# EasyEDA schematic schematic_v1.0.4.json
TITLE: Sheet_1; REV: 1.0; Date: 2023-06-23; Sheet: 1/1; Drawn By: Swapnil Jadhav; Company: XSPEEDAI
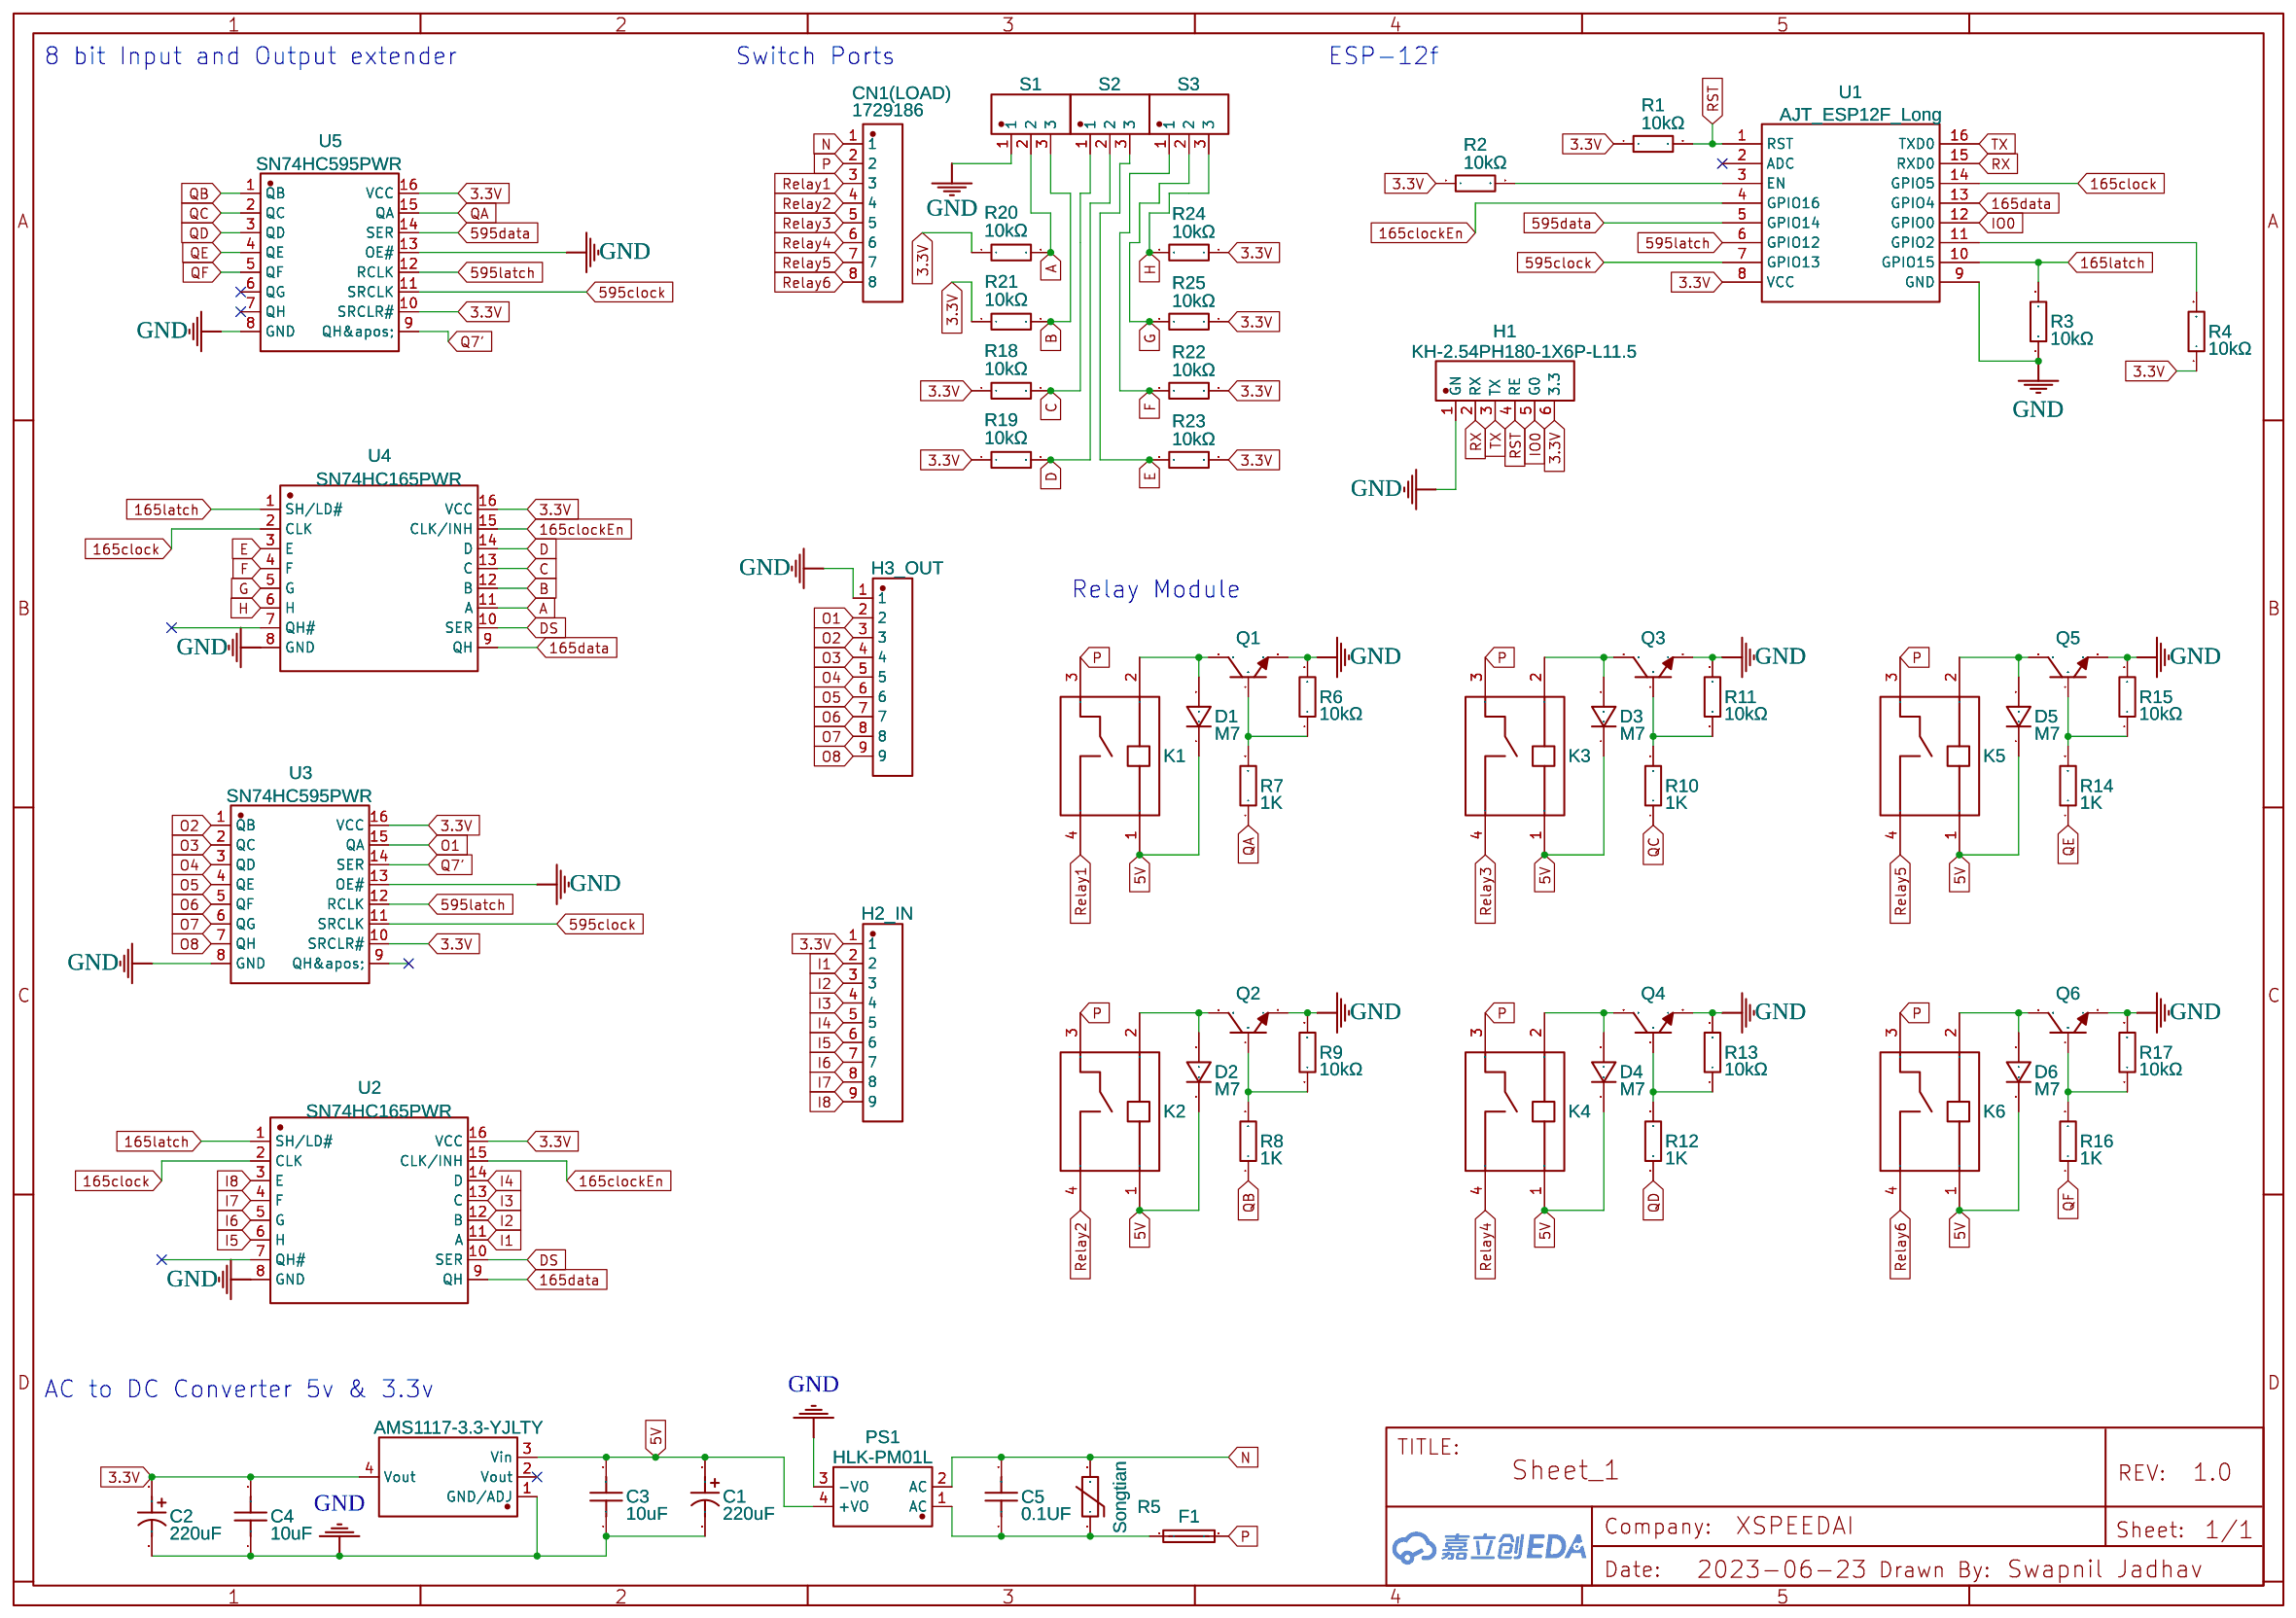
[diagram p0: schematic sheet]

## Parts
C1  220uF  [CAP-SMD_BD6.3-L6.6-W6.6-LS7.2-FD]
C2  220uF  [CAP-SMD_BD6.3-L6.6-W6.6-LS7.2-FD]
C3  10uF  [C0805]
C4  10uF  [C0805]
C5  0.1UF  [CAP-TH_L10.0-W4.5-P7.50-D0.6]
CN1(LOAD)  1729186  [CONN-TH_PHOENIX_1729186]
D1  M7  [SMA_L4.4-W2.8-LS5.4-RD]
D2  M7  [SMA_L4.4-W2.8-LS5.4-RD]
D3  M7  [SMA_L4.4-W2.8-LS5.4-RD]
D4  M7  [SMA_L4.4-W2.8-LS5.4-RD]
D5  M7  [SMA_L4.4-W2.8-LS5.4-RD]
D6  M7  [SMA_L4.4-W2.8-LS5.4-RD]
F1  2009T500MA250V  [FUSE-TH_L8.3-W4.1-P5.08-D0.6]
H1  KH-2.54PH180-1X6P-L11.5  [HDR-TH_6P-P2.54-V-M-1]
H2_IN  KH-2.54PH180-1X9P-L11.5  [HDR-TH_9P-P2.54-V-M]
H3_OUT  KH-2.54PH180-1X9P-L11.5  [HDR-TH_9P-P2.54-V-M]
K1  HF7520-005-HSTP  [RELAY-TH_HF7520-005-HSTP]
K2  HF7520-005-HSTP  [RELAY-TH_HF7520-005-HSTP]
K3  HF7520-005-HSTP  [RELAY-TH_HF7520-005-HSTP]
K4  HF7520-005-HSTP  [RELAY-TH_HF7520-005-HSTP]
K5  HF7520-005-HSTP  [RELAY-TH_HF7520-005-HSTP]
K6  HF7520-005-HSTP  [RELAY-TH_HF7520-005-HSTP]
NO1  AMS1117-3.3-YJLTY  [SOT-223-3_L6.5-W3.4-P2.30-LS7.0-BR]
PS1  HLK-PM01L  [HLK-PM01L]
Q1  SS8050_C181160  [SOT-23-3_L2.9-W1.6-P1.90-LS2.8-BR]
Q2  SS8050_C181160  [SOT-23-3_L2.9-W1.6-P1.90-LS2.8-BR]
Q3  SS8050_C181160  [SOT-23-3_L2.9-W1.6-P1.90-LS2.8-BR]
Q4  SS8050_C181160  [SOT-23-3_L2.9-W1.6-P1.90-LS2.8-BR]
Q5  SS8050_C181160  [SOT-23-3_L2.9-W1.6-P1.90-LS2.8-BR]
Q6  SS8050_C181160  [SOT-23-3_L2.9-W1.6-P1.90-LS2.8-BR]
R1  10kΩ  [R0805]
R2  10kΩ  [R0805]
R3  10kΩ  [R0805]
R4  10kΩ  [R0805]
R5  Songtian  [RES-TH_L14.0-W4.9-P7.50-D0.8-S4.90]
R6  10kΩ  [R0805]
R7  1K  [R0805]
R8  1K  [R0805]
R9  10kΩ  [R0805]
R10  1K  [R0805]
R11  10kΩ  [R0805]
R12  1K  [R0805]
R13  10kΩ  [R0805]
R14  1K  [R0805]
R15  10kΩ  [R0805]
R16  1K  [R0805]
R17  10kΩ  [R0805]
R18  10kΩ  [R0805]
R19  10kΩ  [R0805]
R20  10kΩ  [R0805]
R21  10kΩ  [R0805]
R22  10kΩ  [R0805]
R23  10kΩ  [R0805]
R24  10kΩ  [R0805]
R25  10kΩ  [R0805]
S1  TY381-3.5-03P-14-00AH  [CONN-TH_3P-P3.50_TOPONELEC_TY381-3.5-03P-14-00AH]
S2  TY381-3.5-03P-14-00AH  [CONN-TH_3P-P3.50_TOPONELEC_TY381-3.5-03P-14-00AH]
S3  TY381-3.5-03P-14-00AH  [CONN-TH_3P-P3.50_TOPONELEC_TY381-3.5-03P-14-00AH]
U1  AJT_ESP12F_Long  [AJT_ESP12F_LONG]
U2  SN74HC165PWR  [TSSOP-16_L5.0-W4.4-P0.65-LS6.4-BL]
U3  SN74HC595PWR  [TSSOP-16_L5.0-W4.4-P0.65-LS6.4-BL]
U4  SN74HC165PWR  [TSSOP-16_L5.0-W4.4-P0.65-LS6.4-BL]
U5  SN74HC595PWR  [TSSOP-16_L5.0-W4.4-P0.65-LS6.4-BL]

## Library data of the parts
C1 C2 = MVG 16V 220UF 6.3*7.7: Supplier: LCSC; Supplier Part: C2827940; Manufacturer: SAMYOUNG(韩国三莹); JLCPCB Part Class: Extended Part; Contributor: LCSC
C3 C4 = TCC0805X7R106K100FT: Supplier: LCSC; Supplier Part: C380346; Manufacturer: CCTC(三环); Contributor: LCSC; JLCPCB Part Class: Extended Part
C5 = 250V 0.1UF 5% CBBCapacitor: Supplier: LCSC; Manufacturer: ReliaPro; Supplier Part: C46804
CN1(LOAD) = 1729186: Supplier: LCSC; Supplier Part: C3019615; Manufacturer: Phoenix Contact(菲尼克斯); link: https://atta.szlcsc.com/upload/public/pdf/source/20220519/FDD1F0DA252B24ADE57C07AA9124BB79.pdf; Contributor: lcsc; JLCPCB Part Class: Extended Part
D1-D6 = M7: Supplier: LCSC; Supplier Part: C266550; Manufacturer: BORN(伯恩半导体); Contributor: LCSC; JLCPCB Part Class: Extended Part
F1 = 2009T500MA250V: Supplier: LCSC; Supplier Part: C529783; Manufacturer: Hongda(泓达); Manufacturer Part: 2009T500mA250V; Contributor: LCSC; JLCPCB Part Class: Extended Part
H1 = KH-2.54PH180-1X6P-L11.5: Supplier: LCSC; Supplier Part: C2905486; Manufacturer: kinghelm(金航标); Contributor: LCSC; JLCPCB Part Class: Extended Part
H2_IN H3_OUT = KH-2.54PH180-1X9P-L11.5: Supplier: LCSC; Supplier Part: C2932701; Manufacturer: kinghelm(金航标); Contributor: LCSC; JLCPCB Part Class: Extended Part
K1-K6 = HF7520-005-HSTP: Supplier: LCSC; Manufacturer: HF(宏发); Contributor: LCSC; Supplier Part: C126229; JLCPCB Part Class: Extended Part
NO1 = AMS1117-3.3-YJLTY: Supplier: LCSC; Supplier Part: C9900003397; JLCPCB Part Class: Extended Part; Contributor: LCSC; Manufacturer: null
PS1 = HLK-PM01L: Supplier: HI-LINK; Manufacturer: HI-LINK; Contributor: sbatraAmolvo
Q1-Q6 = SS8050_C181160: Supplier: LCSC; Manufacturer: Hottech(合科泰); Manufacturer Part: SS8050; Contributor: LCSC; Supplier Part: C181160; JLCPCB Part Class: Extended Part
R1-R4 R6 R9 R11 R13 R15 R17-R25 = RMCF0805FT10K0: Supplier: LCSC; Supplier Part: C237755; Manufacturer: SEI(Stackpole Electronics Inc.); Resistance (Ohms): 10K; Contributor: LCSC; JLCPCB Part Class: Extended Part
R5 = STE10D431K1EQ0FST0R0: Supplier: LCSC; Supplier Part: C363065; Manufacturer: STE(松田); Contributor: LCSC; JLCPCB Part Class: Extended Part
R7 R8 R10 R12 R14 R16 = RT0805BRD071KL: Supplier: LCSC; Manufacturer: YAGEO(国巨); Supplier Part: C110774; JLCPCB Part Class: Extended Part; Resistance: 1kΩ
S1-S3 = TY381-3.5-03P-14-00AH: Supplier: LCSC; Supplier Part: C2840326; Manufacturer: Toponelec(拓宜); Contributor: LCSC; JLCPCB Part Class: Extended Part
U1 = AJT_ESP12F_Long: Contributor: AlanTompkins
U2 U4 = SN74HC165PWR: Supplier: LCSC; Manufacturer: TI(德州仪器); Supplier Part: C43420; JLCPCB Part Class: Extended Part
U3 U5 = SN74HC595PWR: Supplier: LCSC; Supplier Part: C273642; Manufacturer: TI(德州仪器); Contributor: LCSC; JLCPCB Part Class: Extended Part

## Nets
3.3V: C2.1 C4.2 H1.6(3.3) H2_IN.1 NO1.4(Vout) R1.1 R2.1 R4.1 R18.1 R19.1 R20.1 R21.1 R22.1 R23.1 R24.1 R25.1 U1.8(VCC) U2.16(VCC) U3.10(SRCLR#) U3.16(VCC) U4.16(VCC) U5.10(SRCLR#) U5.16(VCC)
5V: C1.1 C3.2 D1.1 D2.1 D3.1 D4.1 D5.1 D6.1 K1.1 K2.1 K3.1 K4.1 K5.1 K6.1 NO1.3(Vin) PS1.4(+VO)
GND: C1.2 C2.2 C3.1 C4.1 H1.1(GN) H3_OUT.1 NO1.1(GND/ADJ) PS1.3(-VO) Q1.2(E) Q2.2(E) Q3.2(E) Q4.2(E) Q5.2(E) Q6.2(E) R3.1 R6.2 R9.2 R11.2 R13.2 R15.2 R17.2 S1.1 U1.9(GND) U2.8(GND) U3.8(GND) U3.13(OE#) U4.8(GND) U5.8(GND) U5.13(OE#)
165clock: U1.14(GPIO5) U2.2(CLK) U4.2(CLK)
165clockEn: U1.4(GPIO16) U2.15(CLK/INH) U4.15(CLK/INH)
165data: U1.13(GPIO4) U2.9(QH) U4.9(QH)
165latch: R3.2 U1.10(GPIO15) U2.1(SH/LD#) U4.1(SH/LD#)
595clock: U1.7(GPIO13) U3.11(SRCLK) U5.11(SRCLK)
595data: U1.5(GPIO14) U5.14(SER)
595latch: U1.6(GPIO12) U3.12(RCLK) U5.12(RCLK)
A: R20.2 S1.2 U4.11(A)
B: R21.2 S1.3 U4.12(B)
C: R18.2 S2.1 U4.13(C)
D: R19.2 S2.2 U4.14(D)
DS: U2.10(SER) U4.10(SER)
E: R23.2 S2.3 U4.3(E)
F: R22.2 S3.1 U4.4(F)
G: R25.2 S3.2 U4.5(G)
H: R24.2 S3.3 U4.6(H)
I1: H2_IN.2 U2.11(A)
I2: H2_IN.3 U2.12(B)
I3: H2_IN.4 U2.13(C)
I4: H2_IN.5 U2.14(D)
I5: H2_IN.6 U2.6(H)
I6: H2_IN.7 U2.5(G)
I7: H2_IN.8 U2.4(F)
I8: H2_IN.9 U2.3(E)
IO0: H1.5(G0) U1.12(GPIO0)
N: C5.2 CN1(LOAD).1 PS1.2(AC) R5.2
O1: H3_OUT.2 U3.15(QA)
O2: H3_OUT.3 U3.1(QB)
O3: H3_OUT.4 U3.2(QC)
O4: H3_OUT.5 U3.3(QD)
O5: H3_OUT.6 U3.4(QE)
O6: H3_OUT.7 U3.5(QF)
O7: H3_OUT.8 U3.6(QG)
O8: H3_OUT.9 U3.7(QH)
P: CN1(LOAD).2 F1.2 K1.3 K2.3 K3.3 K4.3 K5.3 K6.3
Q7': U3.14(SER) U5.9(QH')
QA: R7.1 U5.15(QA)
QB: R8.1 U5.1(QB)
QC: R10.1 U5.2(QC)
QD: R12.1 U5.3(QD)
QE: R14.1 U5.4(QE)
QF: R16.1 U5.5(QF)
Relay1: CN1(LOAD).3 K1.4
Relay2: CN1(LOAD).4 K2.4
Relay3: CN1(LOAD).5 K3.4
Relay4: CN1(LOAD).6 K4.4
Relay5: CN1(LOAD).7 K5.4
Relay6: CN1(LOAD).8 K6.4
RST: H1.4(RE) R1.2 U1.1(RST)
RX: H1.2(RX) U1.15(RXD0)
TX: H1.3(TX) U1.16(TXD0)
Net-(C5-1): C5.1 F1.1 PS1.1(AC) R5.1
Net-(D1-2): D1.2 K1.2 Q1.3(C)
Net-(D2-2): D2.2 K2.2 Q2.3(C)
Net-(D3-2): D3.2 K3.2 Q3.3(C)
Net-(D4-2): D4.2 K4.2 Q4.3(C)
Net-(D5-2): D5.2 K5.2 Q5.3(C)
Net-(D6-2): D6.2 K6.2 Q6.3(C)
Net-(Q1-1): Q1.1(B) R6.1 R7.2
Net-(Q2-1): Q2.1(B) R8.2 R9.1
Net-(Q3-1): Q3.1(B) R10.2 R11.1
Net-(Q4-1): Q4.1(B) R12.2 R13.1
Net-(Q5-1): Q5.1(B) R14.2 R15.1
Net-(Q6-1): Q6.1(B) R16.2 R17.1
Net-(R2-2): R2.2 U1.3(EN)
Net-(R4-2): R4.2 U1.11(GPIO2)

Not connected (* = marked no-connect by the designer): NO1 2(Vout)*; U1 2(ADC)*; U2 7(QH#); U3 9(QH'); U4 7(QH#); U5 6(QG)* 7(QH)*

## Notes on the sheet
- 8 bit Input and Output extender
- Switch Ports
- ESP-12f
- Relay Module
- AC to DC Converter 5v & 3.3v
